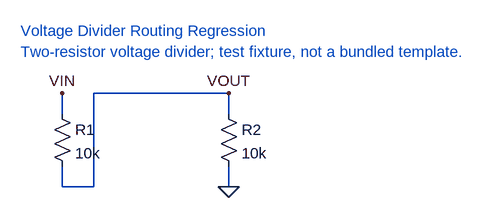
[diagram p0: schematic voltage_divider.asc]
voltage_divider.asc, the LTspice schematic file:
Version 4
SHEET 1 1200 800
TEXT 16 16 Left 2 ;Voltage Divider Routing Regression
TEXT 16 48 Left 2 ;Two-resistor voltage divider; test fixture, not a bundled template.
SYMBOL res 64 128 R0
SYMATTR InstName R1
SYMATTR Value 10k
SYMBOL res 320 128 R0
SYMATTR InstName R2
SYMATTR Value 10k
FLAG 80 112 VIN
WIRE 80 112 80 144
FLAG 336 112 VOUT
WIRE 80 224 80 256
WIRE 80 256 128 256
WIRE 128 112 128 256
WIRE 128 112 336 112
WIRE 336 112 336 144
FLAG 336 256 0
WIRE 336 224 336 256

The netlist it stands for:
* voltage_divider.asc
R1 VIN VOUT 10k
R2 VOUT 0 10k
* Voltage Divider Routing Regression
* Two-resistor voltage divider; test fixture, not a bundled template.
.backanno
.end